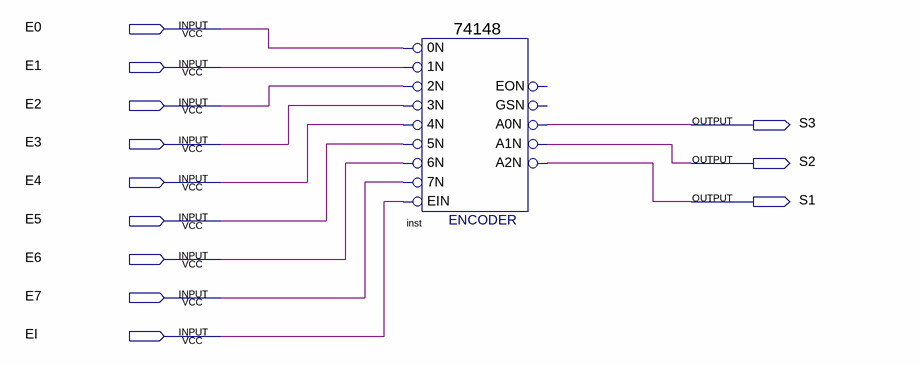
[diagram p0: schematic sheet]
// Quartus schematic circuitoFigura3.bdf as structural Verilog: 1 symbols, 12 pins
module circuitoFigura3 (
  input  E0,
  input  E1,
  input  E2,
  input  E3,
  input  E4,
  input  E5,
  input  E6,
  input  E7,
  input  EI,
  output S3,
  output S2,
  output S1
);

  \74148  inst (
    .\5N (E5), .\0N (E0), .\1N (E1), .\2N (E2), .\3N (E3), .\4N (E4), .EIN(EI), .\6N (E6), .\7N (E7),
    .A1N(S2), .A0N(S3), .A2N(S1));  // open: EON, GSN
endmodule
